# EAGLE design Qwiic_USB_Bridge_ATSAMD21G (EAGLE 9.6.2)
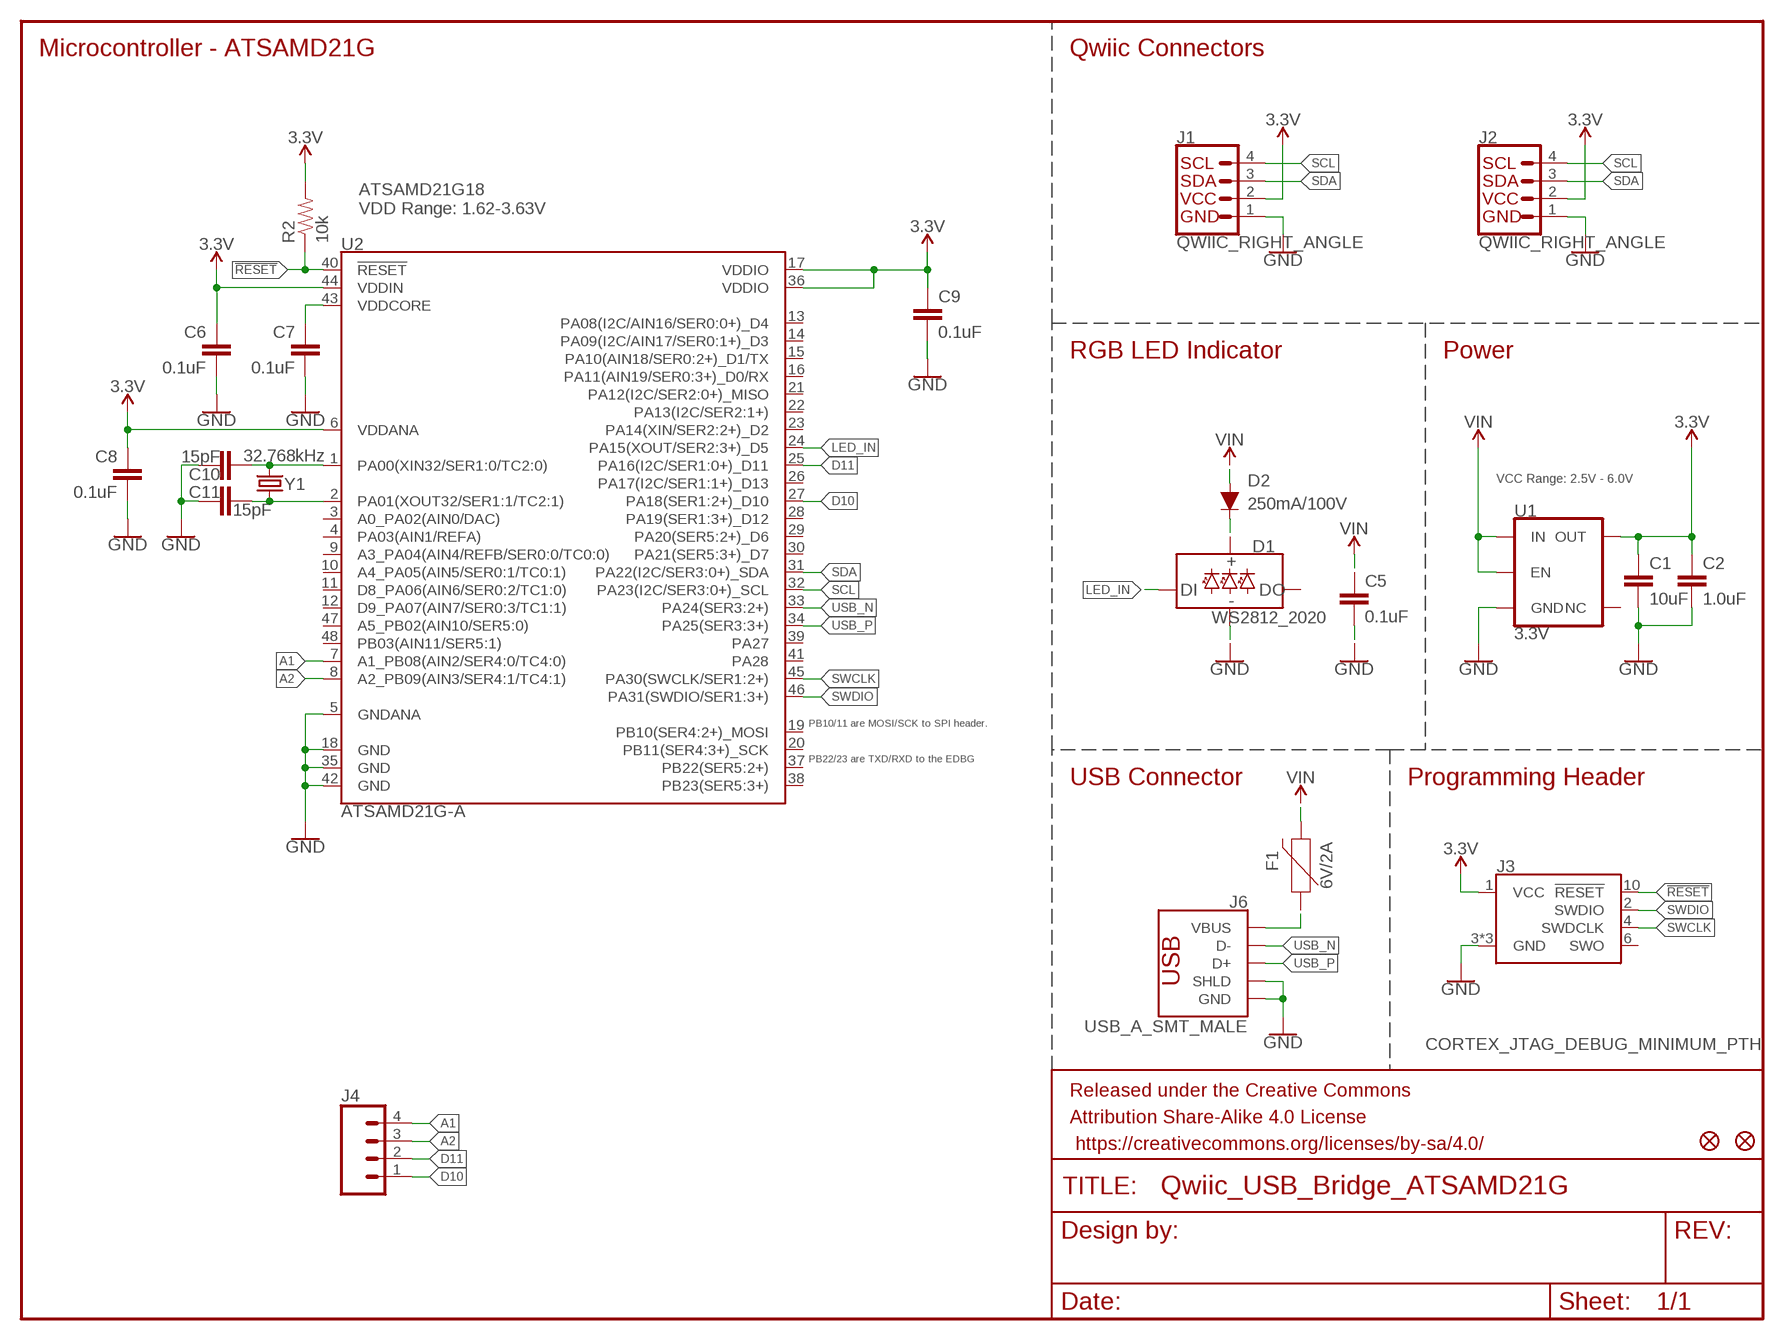
[diagram p0: schematic, sheet 1]

## Parts
C1  10uF  10UF-0603-6.3V-20%  [0603]
C2  1.0uF  1.0UF-0603-16V-10%  [0603]
C5  0.1uF  0.1UF-0603-25V-(+80/-20%)  [0603]
C6  0.1uF  0.1UF-0603-25V-(+80/-20%)  [0603]
C7  0.1uF  0.1UF-0603-25V-(+80/-20%)  [0603]
C8  0.1uF  0.1UF-0603-25V-(+80/-20%)  [0603]
C9  0.1uF  0.1UF-0603-25V-(+80/-20%)  [0603]
C10  15pF  15PF-0603-50V-5%  [0603]
C11  15pF  15PF-0603-50V-5%  [0603]
D1  WS2812_2020  [WS2812-2020]
D2  250mA/100V  DIODE-BAS16J  [SOD-323]
F1  6V/2A  PPTC_6V2A  [1210]
FD1  FIDUCIALUFIDUCIAL  [FIDUCIAL-MICRO]
FD2  FIDUCIALUFIDUCIAL  [FIDUCIAL-MICRO]
FRAME2  FRAME-LETTER  [CREATIVE_COMMONS]
J1  QWIIC_RIGHT_ANGLE  QWIIC_CONNECTORJS-1MM  [JST04_1MM_RA]
J2  QWIIC_RIGHT_ANGLE  QWIIC_CONNECTORJS-1MM  [JST04_1MM_RA]
J3  CORTEX_JTAG_DEBUG_MINIMUM_PTH  [2X5-PTH-1.27MM]
J4  CONN_041X04_NO_SILK  [1X04_NO_SILK]
J6  USB_A_SMT_MALE  [USB-A-SMT-MALE]
R2  10k  10KOHM-0603-1/10W-1%  [0603]
U1  3.3V  V_REG_AP2112K-3.3V  [SOT23-5]
U2  ATSAMD21G-A  [TQFP-48]
Y1  32.768kHz  CRYSTAL-32.768KHZSMD-3.2X1.5  [CRYSTAL-SMD-3.2X1.5MM]

## Nets
3.3V: C1.1 C2.1 C6.1 C8.1 C9.1 J1.2 J2.2 J3.1(VCC) R2.2 U1.5(OUT) U2.6(VDDANA) U2.17(VDDIO) U2.36(VDDIO) U2.44(VDDIN)
!RESET: J3.10(!RESET) R2.1 U2.40(!RESET!)
A1: J4.4 U2.7(A1_PB08(AIN2/SER4:0/TC4:0))
A2: J4.3 U2.8(A2_PB09(AIN3/SER4:1/TC4:1))
D10: J4.1 U2.27(PA18(SER1:2+)_D10)
D11: J4.2 U2.25(PA16(I2C/SER1:0+)_D11)
GND: C1.2 C2.2 C5.2 C6.2 C7.2 C8.2 C9.2 C10.1 C11.2 D1.GND J1.1 J2.1 J3.3(GND) J3.5(GND) J3.9(GND) J6.GND1(GND) J6.SHLD1(SHLD) J6.SHLD2(SHLD) U1.2(GND) U2.5(GNDANA) U2.18(GND) U2.35(GND) U2.42(GND)
LED_IN: D1.DI U2.24(PA15(XOUT/SER2:3+)_D5)
N$1: F1.1 J6.VBUS1(VBUS)
N$2: D1.VCC D2.C
N$3: C10.2 U2.1(PA00(XIN32/SER1:0/TC2:0)) Y1.P$2
N$4: C11.1 U2.2(PA01(XOUT32/SER1:1/TC2:1)) Y1.P$1
SCL: J1.4 J2.4 U2.32(PA23(I2C/SER3:0+)_SCL)
SDA: J1.3 J2.3 U2.31(PA22(I2C/SER3:0+)_SDA)
SWCLK: J3.4(SWDCLK) U2.45(PA30(SWCLK/SER1:2+))
SWDIO: J3.2(SWDIO) U2.46(PA31(SWDIO/SER1:3+))
USB_N: J6.D-1(D-) U2.33(PA24(SER3:2+))
USB_P: J6.D+1(D+) U2.34(PA25(SER3:3+))
VDDCORE1: C7.1 U2.43(VDDCORE)
VIN: C5.1 D2.A F1.2 U1.1(IN) U1.3(EN)
Unconnected: D1.DO J3.6(SWO) U1.4(NC) U2.3(A0_PA02(AIN0/DAC)) U2.4(PA03(AIN1/REFA)) U2.9(A3_PA04(AIN4/REFB/SER0:0/TC0:0)) U2.10(A4_PA05(AIN5/SER0:1/TC0:1)) U2.11(D8_PA06(AIN6/SER0:2/TC1:0)) U2.12(D9_PA07(AIN7/SER0:3/TC1:1)) U2.13(PA08(I2C/AIN16/SER0:0+)_D4) U2.14(PA09(I2C/AIN17/SER0:1+)_D3) U2.15(PA10(AIN18/SER0:2+)_D1/TX) U2.16(PA11(AIN19/SER0:3+)_D0/RX) U2.19(PB10(SER4:2+)_MOSI) U2.20(PB11(SER4:3+)_SCK) U2.21(PA12(I2C/SER2:0+)_MISO) U2.22(PA13(I2C/SER2:1+)) U2.23(PA14(XIN/SER2:2+)_D2) U2.26(PA17(I2C/SER1:1+)_D13) U2.28(PA19(SER1:3+)_D12) U2.29(PA20(SER5:2+)_D6) U2.30(PA21(SER5:3+)_D7) U2.37(PB22(SER5:2+)) U2.38(PB23(SER5:3+)) U2.39(PA27) U2.41(PA28) U2.47(A5_PB02(AIN10/SER5:0)) U2.48(PB03(AIN11/SER5:1))

## Notes on the sheet
- Microcontroller - ATSAMD21G | Qwiic Connectors
- ATSAMD21G18
  VDD Range: 1.62-3.63V
- RGB LED Indicator | Power
- VCC Range: 2.5V - 6.0V
- PB10/11 are MOSI/SCK to SPI header.
- PB22/23 are TXD/RXD to the EDBG
- USB Connector | Programming Header

## Library data of the parts
C1 = SparkFun-Capacitors:10UF: 10.0µF ceramic capacitors A capacitor is a passive two-terminal electrical component used to store electrical energy temporarily in an electric field.; PROD_ID: CAP-11015
C2 = SparkFun-Capacitors:1.0UF: 1µF ceramic capacitors A capacitor is a passive two-terminal electrical component used to store electrical energy temporarily in an electric field.; PROD_ID: CAP-00868
C5-C9 = SparkFun-Capacitors:0.1UF: 0.1µF ceramic capacitors A capacitor is a passive two-terminal electrical component used to store electrical energy temporarily in an electric field.; PROD_ID: CAP-00810
C10 C11 = SparkFun-Capacitors:15PF: 15pF ceramic capacitors A capacitor is a passive two-terminal electrical component used to store electrical energy temporarily in an electric field.; PROD_ID: CAP-07881
D1 = SparkFun-LED:WS2812: Addressable RGB LED - 1 Wire Common names: WS2812, SK6812, Neopixel, APA-106, etc. SMD LED with built-in controller IC. Color: Red/Green/Blue SparkFun Products: LED-SMD RGB (WS2812) <https://www.sparkfun.com/products/11821> LED - RGB Addressable, PTH, 5mm Diffused (5 Pack) <https://www.sparkfun.com/products/12986> LED - RGB Addressable, PTH, 5mm Clear (5 Pack) <https://www.sparkfun.com/products/12999> Blynk Board - ESP8266 <https://www.sparkfun.com/products/13794> Datasheet referenced for footprint: WS2812B-PTH <https://cdn.sparkfun.com/datasheets/Components/LED/COM-12877.pdf>; PROD_ID: DIO-15591
D2 = SparkFun-DiscreteSemi:DIODE: Diode These are standard reverse protection diodes and small signal diodes. SparkFun Products: SparkFun SparkPunk Sound Kit <https://www.sparkfun.com/products/11177> SparkFun ESP8266 Thing <https://www.sparkfun.com/products/13231>; PROD_ID: DIO-09646
F1 = SparkFun-Fuses:PPTC: Resettable Fuse PPTC Resettable Fuse. Really a sort of resistor with a polymeric positive temperature coefficient whose resistance increases dramatically with an increase in temperature. When heated by the power passing through the resistance rises causing the current to be limited, protecting the circuit. This is achieved by the transition of the polymer from a crystalline to an amorphous state where the conductive carbon separates breaking the conductive pathways found in the cool crystalline structure. When a PPTC cools back down it resumes conducting letting the circuit turn back on. SparkFun Products: SparkFun RedBoard - Programmed with Arduino <https://www.sparkfun.com/products/12757> Pro Micro - 5V/16MHz <https://www.sparkfun.com/products/12640> Arduino Pro 328 - 5V/16MHz <https://www.sparkfun.com/products/10915> MP3 Trigger <https://www.sparkfun.com/products/13720>; PROD_ID: RES-14313
FD1 FD2 = SparkFun-Aesthetics:FIDUCIAL: Fiducial Alignment Points Point-of-reference for pick-and-place machines and other optical instruments.
FRAME2 = SparkFun-Aesthetics:FRAME-LETTER: Schematic Frame - Letter Standard 8.5x11 US Letter frame
J1 J2 = SparkFun-Connectors:QWIIC_CONNECTOR: SparkFun I2C Standard Qwiic Connector An SMD 1mm pitch JST connector makes it easy and quick (get it? Qwiic?) to connect I2C devices to each other. The Qwiic system <http://www.sparkfun.com/qwiic> enables fast and solderless connection between popular platforms and various sensors and actuators. We carry 200mm <https://www.sparkfun.com/products/14204>, 100mm <https://www.sparkfun.com/products/14205>, 50mm <https://www.sparkfun.com/products/14206>, and breadboard friendly <https://www.sparkfun.com/products/14207> Qwiic cables. We also offer 10 pcs strips <https://www.sparkfun.com/products/14323> the SMD connectors.; PROD_ID: CONN-13694
J3 = SparkFun-Connectors:CORTEX_JTAG_DEBUG_MINIMUM: Cortex Debug Connector - 10 pin Supports JTAG debug, Serial Wire debug, and Serial Wire Viewer. PTH and SMD connector options available. General Connector Information <http://infocenter.arm.com/help/topic/com.arm.doc.faqs/attached/13634/cortex_debug_connectors.pdf> Products: PTH Connector <http://www.digikey.com/product-detail/en/cnc-tech/3220-10-0100-00/1175-1627-ND/3883661> -via Digi-Key SparkFun PSoc <https://www.sparkfun.com/products/13229> SparkFun T <https://www.sparkfun.com/products/13810>
J4 = SparkFun-Connectors:CONN_04: Multi connection point. Often used as Generic Header-pin footprint for 0.1 inch spaced/style header connections On any of the 0.1 inch spaced packages, you can populate with these: Break Away Headers - Straight <https://www.sparkfun.com/products/116> (PRT-00116) Break Away Male Headers - Right Angle <https://www.sparkfun.com/products/553> (PRT-00553) Female Headers <https://www.sparkfun.com/products/115> (PRT-00115) Break Away Headers - Machine Pin <https://www.sparkfun.com/products/117> (PRT-00117) Break Away Female Headers - Swiss Machine Pin <https://www.sparkfun.com/products/743> (PRT-00743) For SCREWTERMINALS and SPRING TERMINALS visit here: Screw Terimnals on SparkFun.com <https://www.sparkfun.com/search/results?term=Screw+Terminals> (5mm/3.5mm/2.54mm spacing) This device is also useful as a general connection point to wire up your design to another part of your project. Our various solder wires solder well into these plated through hole pads. Hook-Up Wire - Assortment (Stranded, 22 AWG) <https://www.sparkfun.com/products/11375> (PRT-11375) Hook-Up Wire - Assortment (Solid Core, 22 AWG) <https://www.sparkfun.com/products/11367> (PRT-11367) View the entire wire category on our website here <https://www.sparkfun.com/categories/141> Special notes: Molex polarized connector foot print use with SKU : PRT-08231 with associated crimp pins and housings. 1MM SMD Version SKU: PRT-10208; PROD_ID: CONN-09696
J6 = SparkFun-Connectors:USB_A: USB-A Connector Male and female variants, as well as PTH and SMT variants SparkFun Products: SparkFun XBee Explorer Dongle <https://www.sparkfun.com/products/11697> PTH Male SparkFun MicroView-USB Programmer <https://www.sparkfun.com/products/12924> SMT Male SparkFun USB Type A Female Breakout <https://www.sparkfun.com/products/12700> SMT Female; PROD_ID: CONN-11499
R2 = SparkFun-Resistors:10KOHM: 10kΩ resistor A resistor is a passive two-terminal electrical component that implements electrical resistance as a circuit element. Resistors act to reduce current flow, and, at the same time, act to lower voltage levels within circuits. - Wikipedia; PROD_ID: RES-00824
U1 = SparkFun-IC-Power:V_REG_AP2112: AP2112 - 600mA CMOS LDO Regulator w/ Enable The AP2112 is CMOS process low dropout linear regulator with enable function, the regulator delivers a guaranteed 600mA (min.) continuous load current. Features Output Voltage Accuracy: ±1.5% Output Current: 600mA (Min.) Foldback Short Current Protection: 50mA Enable Function to Turn ON/OFF VOUT Low Dropout Voltage (3.3V): 250mV (Typ.) @IOUT=600mA Excellent Load Regulation: 0.2%/A (Typ.) Excellent Line Regulation: 0.02%/V (Typ.) Low Quiescent Current: 55μA (Typ.) Low Standby Current: 0.01μA (Typ.) Low Output Noise: 50μVRMS PSRR: 100Hz -65dB, 1kHz -65dB OTSD Protection Stable with 1.0μF Flexible Cap: Ceramic, Tantalum and Aluminum Electrolytic Operation Temperature Range: -40°C to 85°C ESD: MM 400V, HBM 4000V; PROD_ID: VREG-12457
U2 = SparkFun-IC-Microcontroller:ATSAMD21G: Atmel SAMD21G SMART ARM-Based Microcontroller The Atmel ® | SMART ™ SAM D21 is a series of low-power microcontrollers using the 32-bit ARM ® Cortex ® -M0+ processor, and ranging from 32- to 64-pins with up to 256KB Flash and 32KB of SRAM. The SAM D21 devices operate at a maximum frequency of 48MHz and reach 2.46 CoreMark/MHz. They are designed for simple and intuitive migration with identical peripheral modules, hex compatible code, identical linear address map and pin compatible migration paths between all devices in the product series. All devices include intelligent and flexible peripherals, Atmel Event System for inter-peripheral signaling, and support for capacitive touch button, slider and wheel user interfaces. Datasheet <https://cdn.sparkfun.com/datasheets/Dev/Arduino/Boards/Atmel-42181-SAM-D21_Datasheet.pdf> SparkFun Products SparkFun SAMD21 Mini Breakout <https://www.sparkfun.com/products/13664> (DEV-13664) SparkFun SAMD21 Dev Breakout <https://www.sparkfun.com/products/13672> (DEV-13672) (DEV-14926); PROD_ID: IC-13064
Y1 = SparkFun-Clocks:CRYSTAL-32.768KHZ: 32.768kHz Crystal Frequency: 32.768kHz Frequency Stability: ±20ppm Load Capacitance: 12.5pF (PTH-2X6 & SMD-3.2X1.5), 6pF (SMD-2X6) SparkFun Products: SparkFun BigTime Watch Kit <https://www.sparkfun.com/products/11734> SparkFun nRF52832 Breakout <https://www.sparkfun.com/products/13990> SparkFun Real Time Clock Module <https://www.sparkfun.com/products/12708>; PROD_ID: XTAL-13062

## Net classes
1 vcc: width 0 mm

## Board
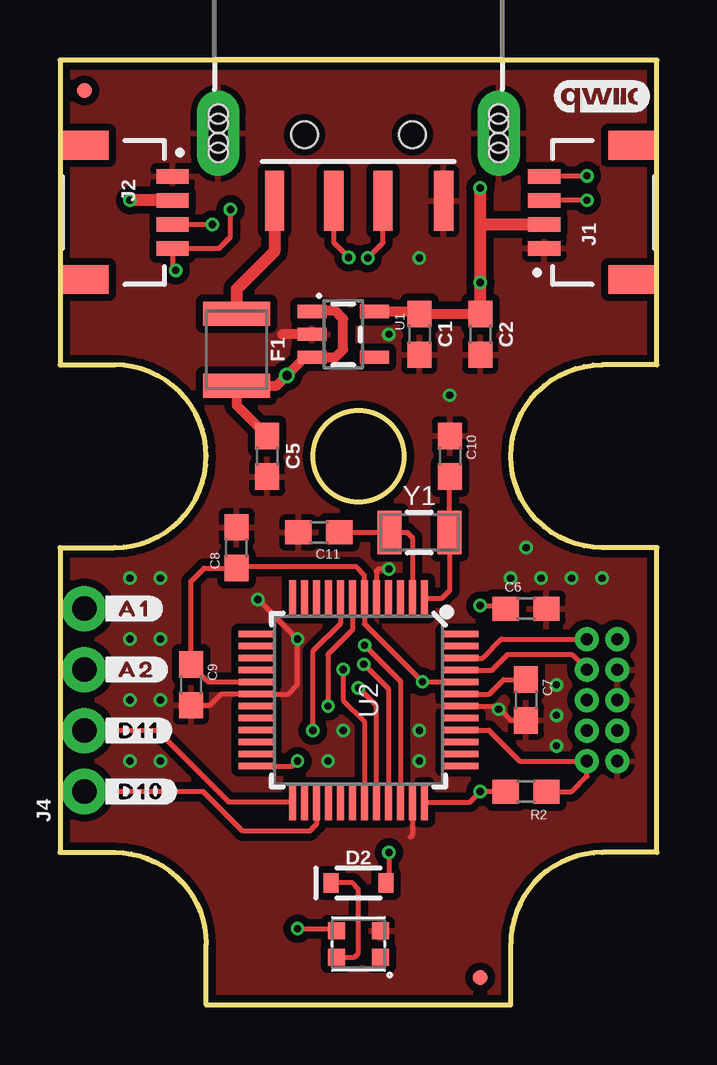
[diagram p1: board, top side]
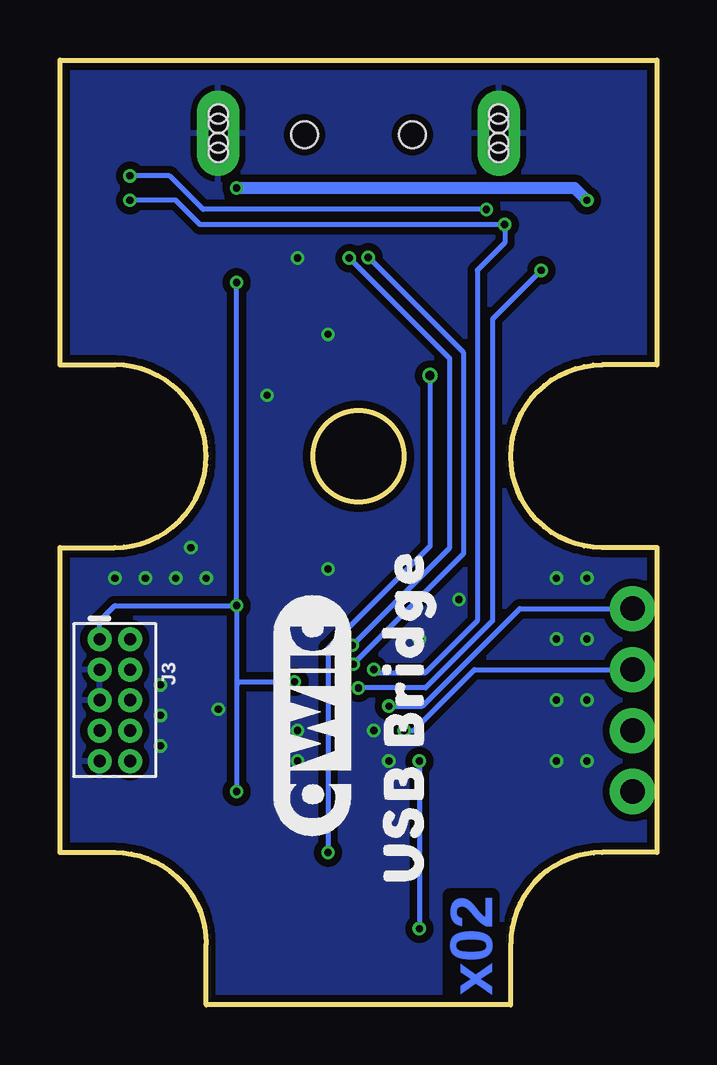
[diagram p2: board, bottom side, seen from below]

Size 24.89 x 39.37 mm. Coordinates in mm from the lower left corner, seen from the top.
Outline: 6.1,0 18.8,0 18.8,2.54 arc-90 22.61,6.35 24.89,6.35 24.89,19.05 22.61,19.05 arc-180 22.61,26.67 24.89,26.67 24.89,39.37 0,39.37 0,26.67 2.29,26.67 arc-180 2.29,19.05 0,19.05 0,6.35 2.29,6.35 arc-90 6.1,2.54 6.1,0
Outline: circle at 12.45,22.86 radius 1.91
Copper layers (1*16): Top 0.035mm / dielectric 1.5mm / Bottom 0.035mm
Design rules "SparkFun-2-Layer-Minimum-JLCPCB": minimum track width 5mil, minimum drill 0.3mm, track to track 5mil, track to pad 5mil, pad to pad 5mil, via to via 5mil, smd to smd 5mil, copper to edge 7mil, drill to drill 7mil, minimum pad ring 5mil, minimum via ring 5mil, stop-mask expansion 4mil, vias tented up to drill 25mil, thermal gap 10mil

### Footprints (pad centres in the part's own frame; a part is rotated, then mirrored left to right if it is on the bottom)
0603 = smd 1.1 x 1: 1 -0.85,0; 2 0.85,0
WS2812-2020 = smd 0.7 x 0.7: DI -0.915,0.55; DO 0.915,-0.55; GND 0.915,0.55; VCC -0.915,-0.55
SOD-323 = smd 0.63 x 0.83: A 1.15,0; C -1.15,0
1210 = smd 1 x 2.8: 1 -1.5,0; 2 1.5,0
FIDUCIAL-MICRO = smd 0.635 x 0.635: 1 0,0
JST04_1MM_RA = smd 0.6 x 1.35: 1 -1.5,0; 2 -0.5,0; 3 0.5,0; 4 1.5,0 | smd 1.2 x 2: NC1 2.8,-3.675; NC2 -2.8,-3.675
2X5-PTH-1.27MM = drill 0.508 pad 1: 1 -2.54,-0.635; 2 -2.54,0.635; 3 -1.27,-0.635; 4 -1.27,0.635; 5 0,-0.635; 6 0,0.635; 7 1.27,-0.635; 8 1.27,0.635; 9 2.54,-0.635; 10 2.54,0.635
1X04_NO_SILK = drill 1.016 pad 1.88: 1 0,0; 2 2.54,0; 3 5.08,0; 4 7.62,0
USB-A-SMT-MALE = smd 2.5 x 0.8: D+1 10.95,1.027; D-1 10.95,-1.027; GND1 10.95,3.551; VBUS1 10.95,-3.5 | drill 0.8 pad 1.778 long: SHLD1 8.13,-5.85; SHLD2 8.13,5.85 | hole 1.1: 8.2,2.25; 8.2,-2.25 | hole 0.8: 8.53,-5.85; 8.93,-5.85; 7.73,-5.85; 7.33,-5.85; 8.53,5.85; 8.93,5.85; 7.73,5.85; 7.33,5.85
SOT23-5 = smd 0.55 x 1.2: 1 -0.95,-1.3; 2 0,-1.3; 3 0.95,-1.3; 4 0.95,1.3; 5 -0.95,1.3
TQFP-48 = smd 1.5 x 0.28: 1 -4.25,2.75; 2 -4.25,2.25; 3 -4.25,1.75; 4 -4.25,1.25; 5 -4.25,0.75; 6 -4.25,0.25; 7 -4.25,-0.25; 8 -4.25,-0.75; 9 -4.25,-1.25; 10 -4.25,-1.75; 11 -4.25,-2.25; 12 -4.25,-2.75; 25 4.25,-2.75; 26 4.25,-2.25; 27 4.25,-1.75; 28 4.25,-1.25; 29 4.25,-0.75; 30 4.25,-0.25; 31 4.25,0.25; 32 4.25,0.75; 33 4.25,1.25; 34 4.25,1.75; 35 4.25,2.25; 36 4.25,2.75 | smd 0.28 x 1.5: 13 -2.75,-4.25; 14 -2.25,-4.25; 15 -1.75,-4.25; 16 -1.25,-4.25; 17 -0.75,-4.25; 18 -0.25,-4.25; 19 0.25,-4.25; 20 0.75,-4.25; 21 1.25,-4.25; 22 1.75,-4.25; 23 2.25,-4.25; 24 2.75,-4.25; 37 2.75,4.25; 38 2.25,4.25; 39 1.75,4.25; 40 1.25,4.25; 41 0.75,4.25; 42 0.25,4.25; 43 -0.25,4.25; 44 -0.75,4.25; 45 -1.25,4.25; 46 -1.75,4.25; 47 -2.25,4.25; 48 -2.75,4.25
CRYSTAL-SMD-3.2X1.5MM = smd 1 x 1.8: P$1 -1.25,0; P$2 1.25,0

### Placement (x,y rotation side)
C1  14.99,27.94 270 top
C2  17.53,27.94 270 top
C5  8.64,22.86 270 top
C6  19.43,16.51 0 top
C7  19.43,12.7 270 top
C8  7.37,19.05 90 top
C9  5.46,13.34 270 top
C10  16.26,22.86 270 top
C11  10.79,19.68 180 top
D1  12.45,2.54 0 top
D2  12.45,5.08 0 top
F1  7.37,27.3 270 top
FD1  1.02,38.1 0 top
FD2  17.53,1.14 0 top
FRAME2  -7.87,-11.43 0 top  (outside the outline)
J1  20.19,33.02 90 top
J2  4.7,33.02 270 top
J3  22.61,12.7 270 bottom
J4  1.02,8.89 90 top
J6  12.45,44.45 270 top
R2  19.43,8.89 180 top
U1  11.81,27.94 270 top
U2  12.45,12.7 270 top
U$1  [#_A1#0]  1.65,16.51 0 top
U$2  [#_A2#0]  1.65,13.97 0 top
U$3  [#_D11#0]  1.65,11.43 0 top
U$4  [#_D10#0]  1.65,8.89 0 top
U$7  [QWIIC_10MM]  14.35,12.06 90 bottom
U$8  [USB_BRIDGE0]  10.54,12.06 90 bottom
U$9  [QWIIC_4MM]  22.61,37.85 0 top
Y1  14.99,19.68 0 top

### Tracks (layer width: path | path; a pad name or v marks a point on that pad's centre or on a via)
3.3V  (via drill 0.3)
  Top 0.203: v17.53,16.64 18.45,16.64 C6.1 | U2.44 v15.12,13.45 v15.11,13.46 12.7,15.88 U2.6 12.7,17.91 12.36,18.25 7.41,18.25 C8.1 6.01,18.2 5.46,17.65 C9.1 6.2,13.45 U2.17 | U2.36 17.09,8.45 v17.53,8.89 R2.2
  Top 0.406: U1.5 14.89,28.89 C1.1 C2.1
  Top 0.508: J2.2 2.93,33.52 v2.92,33.53 | C2.1 v17.53,30.1 17.53,32.51 | 17.53,32.51 v17.53,34.04 | J1.2 17.53,32.51
  Bottom 0.203: J3.1 23.24,16 22.61,16.64 v17.53,16.64 | v17.53,16.64 17.53,13.34 | 17.53,13.34 v17.53,8.89 | 17.53,13.34 17.4,13.46 v15.11,13.46 | v17.53,16.64 v17.53,30.1
  Bottom 0.508: v2.92,33.53 3.43,34.04 v17.53,34.04
!RESET
  Top 0.203: U2.40 17.89,11.45 19.18,10.16 J3.10 21.97,9.53 21.34,8.89 R2.1
A1  (via drill 0.3)
  Top 0.203: U2.7 12.2,15.62 11.18,14.61 v11.18,12.45
  Bottom 0.203: v11.18,12.45 9.78,12.45 5.71,16.51 J4.4
A2  (via drill 0.3)
  Top 0.203: U2.8 11.7,15.89 10.54,14.73 v10.54,11.43
  Bottom 0.203: v10.54,11.43 10.16,11.43 7.62,13.97 J4.3
D10
  Top 0.203: U2.27 10.7,7.52 10.41,7.24 7.62,7.24 5.97,8.89 J4.1
D11
  Top 0.203: U2.25 7.04,8.45 4.06,11.43 J4.2
GND  (via drill 0.3)
  Top 0.203: U2.35 14.7,7.08 14.61,6.99 | 18.21,12.45 18.81,11.85 C7.2 | C9.2 6.26,12.48 6.73,12.95 U2.18 9.52,12.95 9.91,13.34 v9.91,15.24 v8.26,16.89 | U2.42 18.16,12.45 v18.29,12.32 | U2.5 13.2,18.09 13.27,18.16 v13.72,18.16
  Top 0.406: U1.2 9.27,27.94
  other vias: 20.7,12.06 19.43,19.05 18.8,17.78 20.07,17.78 20.7,13.34 21.34,17.78 22.61,17.78 20.7,10.79 2.92,10.16 4.19,10.16 2.92,12.7 4.19,12.7 2.92,17.78 4.19,17.78 2.92,15.24 4.19,15.24 11.18,10.16 14.99,10.16 14.99,11.43 11.81,11.43 16.26,25.4 13.72,27.94 14.99,31.11
  pour Top (isolate 0.305): 0,0 0,39.37 24.89,39.37 24.89,0
  pour Bottom (isolate 0.305): 0,39.37 24.89,39.37 24.89,0 0,0
LED_IN  (via drill 0.3)
  Top 0.203: U2.24 9.7,9.95 v9.91,10.16 | v9.91,3.17 11.45,3.17 D1.DI
  Bottom 0.203: v9.91,10.16 v9.91,3.17
N$1
  Top 0.508: J6.VBUS1 8.95,31.4 7.37,29.82 F1.1
N$2
  Top 0.203: D1.VCC 12.28,1.99 12.45,2.16 12.45,4.83 12.19,5.08 D2.C
N$3
  Top 0.203: U2.1 15.93,16.95 16.26,17.27 16.26,19.66 Y1.P$2 16.24,21.99 C10.2
N$4
  Top 0.203: U2.2 14.7,19.47 14.48,19.68 Y1.P$1 C11.1
SCL  (via drill 0.3)
  Top 0.203: v7.11,33.15 7.11,32 6.63,31.52 J2.4 4.7,30.73 v4.83,30.61 | v21.97,34.54 21.95,34.52 J1.4 | U2.32 13.2,12.46 v12.45,13.21
  Bottom 0.203: v4.83,30.61 6.86,28.57 6.86,16 9.65,13.21 v12.45,13.21 | v21.97,34.54 20.32,34.54 18.92,33.15 v7.11,33.15
SDA  (via drill 0.3)
  Top 0.203: J2.3 v6.34,32.52 v6.35,32.51 | v21.97,33.53 21.96,33.52 J1.3 | v11.81,13.97 11.81,12.7 12.7,11.81 U2.31
  Bottom 0.203: v11.81,13.97 11.68,13.84 9.65,13.84 7.49,16 7.49,30.61 6.35,31.75 v6.35,32.51 19.05,32.51 20.07,33.53 v21.97,33.53
SWCLK
  Top 0.203: U2.45 18.01,13.95 18.67,14.61 21.34,14.61 J3.4
SWDIO
  Top 0.203: U2.46 17.62,14.45 18.41,15.24 J3.2
USB_N  (via drill 0.3)
  Top 0.203: U2.33 13.7,13.17 v12.67,14.19 | J6.D-1 11.42,31.76 v12.03,31.15
  Bottom 0.203: v12.03,31.15 8.05,27.16 8.05,18.81 v12.67,14.19
USB_P  (via drill 0.3)
  Top 0.203: U2.34 14.2,13.49 v12.7,14.99 | J6.D+1 13.47,31.76 v12.83,31.11
  Bottom 0.203: v12.83,31.11 8.64,26.92 8.64,19.05 v12.7,14.99
VDDCORE1
  Top 0.203: U2.43 17.9,12.95 18.5,13.55 C7.1
VIN  (via drill 0.3, 0.38)
  Top 0.203: 10.54,28.92 U1.1 | v13.72,6.35 13.72,5.2 D2.A
  Top 0.406: 10.54,28.92 11.47,28.92 11.81,28.57 11.81,27.3 11.5,26.99 U1.3 10.23,26.99 v9.46,26.23 9.04,25.8 F1.2 7.37,24.98 C5.1
  Bottom 0.203: v9.46,26.23 9.46,19.11 13.72,14.86 v13.72,6.35

### Text on the board
Bottom: x02
Measures: Units in Inches